# EAGLE design pulse-generator (EAGLE 7.7.0)

## Sheet 1 of 2
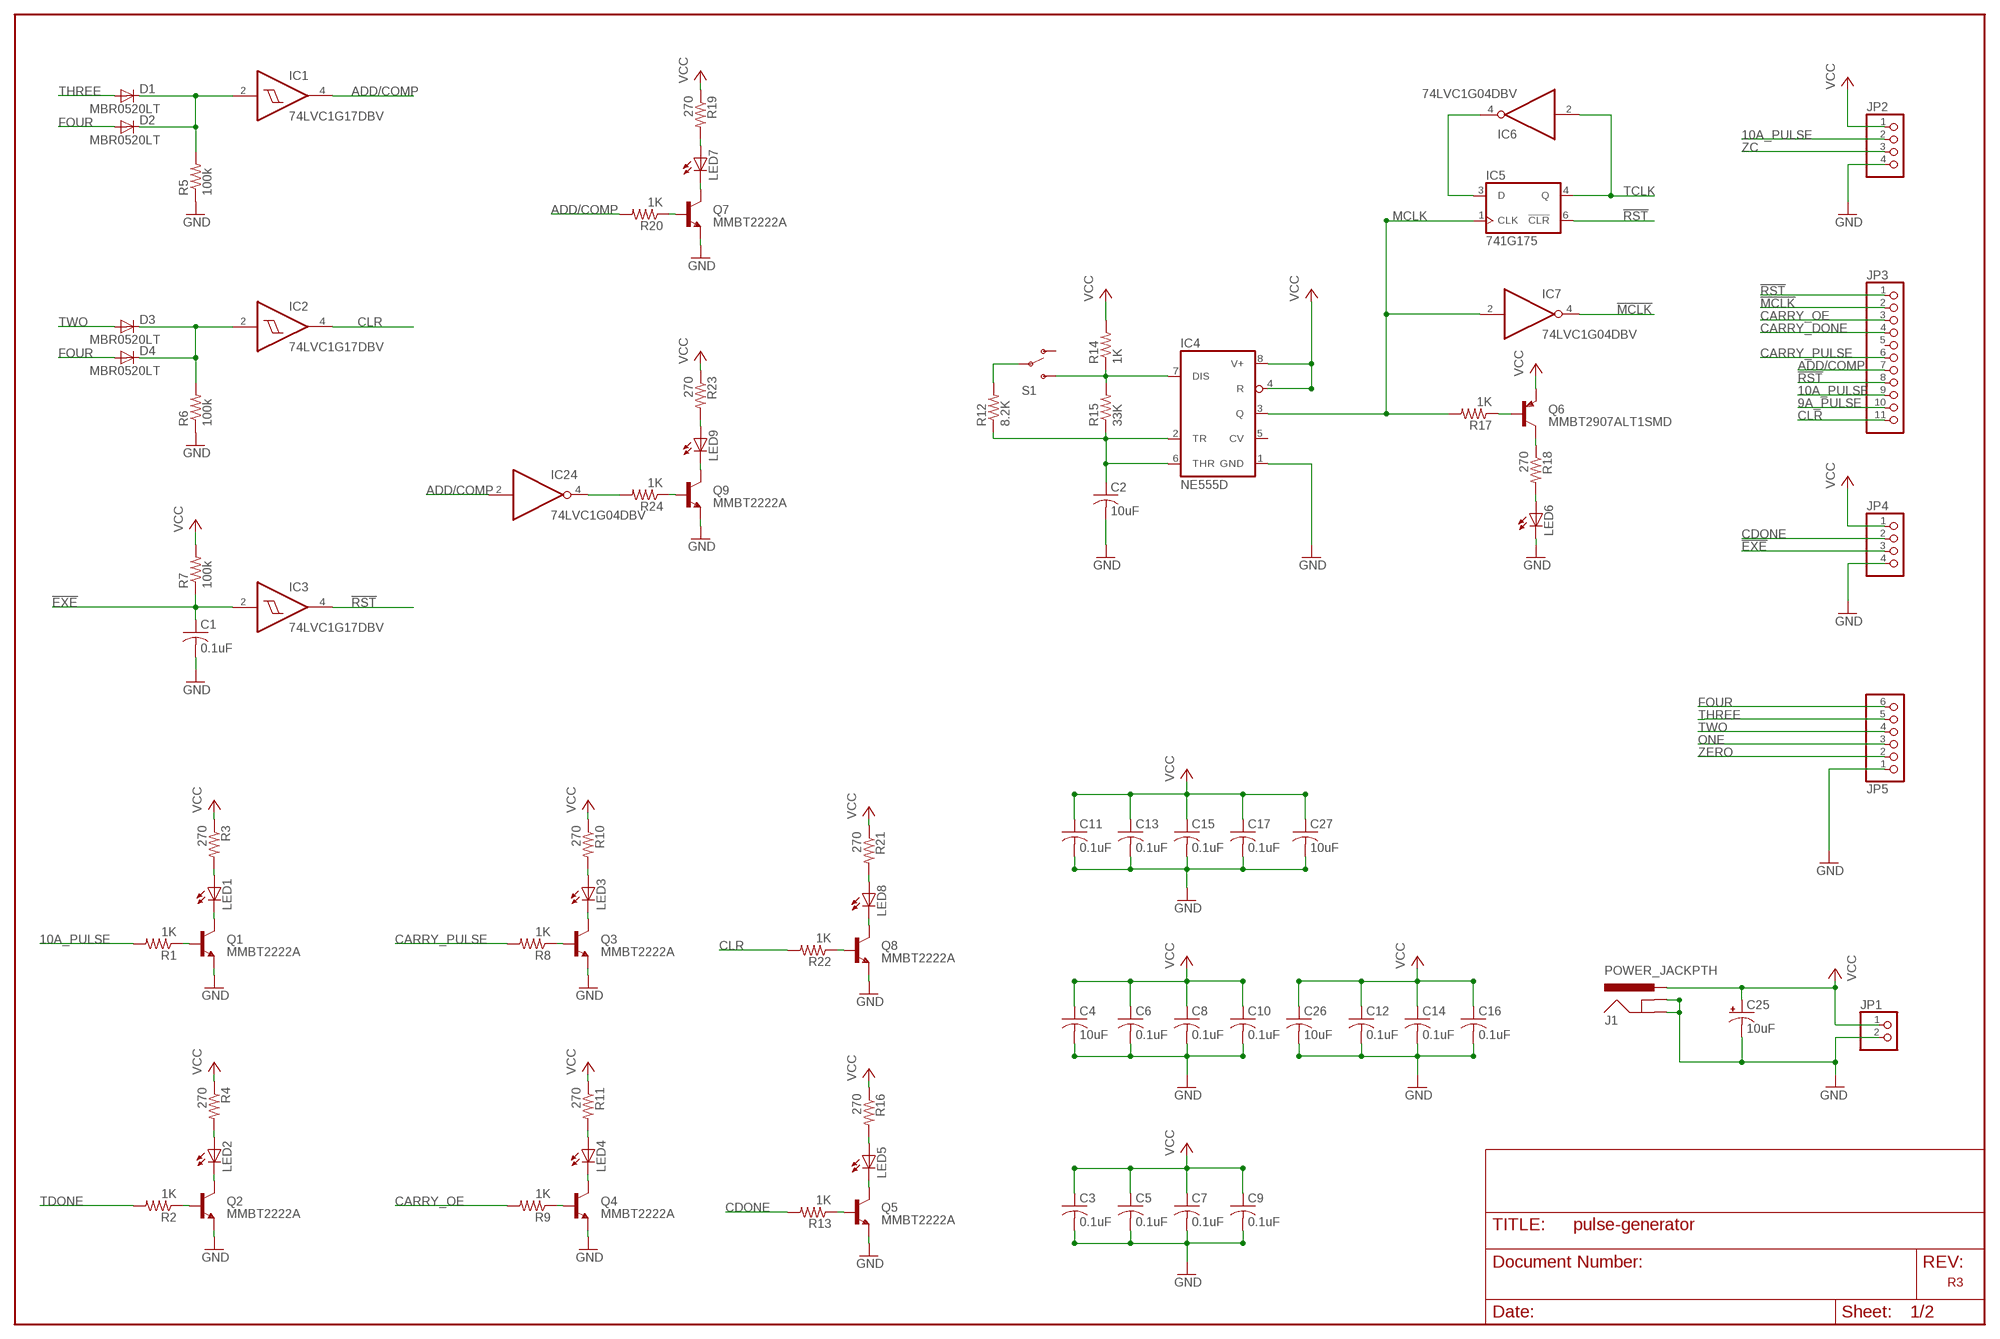
[diagram p0: schematic, sheet 1]

### Parts
C1  0.1uF  C-USC0805  [C0805]
C2  10uF  C-USC0805  [C0805]
C3  0.1uF  C-USC0603  [C0603]
C4  10uF  C-USC0805  [C0805]
C5  0.1uF  C-USC0603  [C0603]
C6  0.1uF  C-USC0603  [C0603]
C7  0.1uF  C-USC0805  [C0805]
C8  0.1uF  C-USC0603  [C0603]
C9  0.1uF  C-USC0603  [C0603]
C10  0.1uF  C-USC0603  [C0603]
C11  0.1uF  C-USC0603  [C0603]
C12  0.1uF  C-USC0603  [C0603]
C13  0.1uF  C-USC0603  [C0603]
C14  0.1uF  C-USC0603  [C0603]
C15  0.1uF  C-USC0603  [C0603]
C16  0.1uF  C-USC0603  [C0603]
C17  0.1uF  C-USC0603  [C0603]
C25  10uF  10UF-16V-10%(TANT)  [EIA3216]
C26  10uF  C-USC0805  [C0805]
C27  10uF  C-USC0805  [C0805]
D1  MBR0520LT  [SOD123]
D2  MBR0520LT  [SOD123]
D3  MBR0520LT  [SOD123]
D4  MBR0520LT  [SOD123]
IC1  74LVC1G17DBV  [SOT23-5]
IC2  74LVC1G17DBV  [SOT23-5]
IC3  74LVC1G17DBV  [SOT23-5]
IC4  NE555D  [SO08]
IC5  741G175  [DBV_R-PDSO-G6]
IC6  74LVC1G04DBV  [SOT23-5]
IC7  74LVC1G04DBV  [SOT23-5]
IC24  74LVC1G04DBV  [SOT23-5]
J1  POWER_JACKPTH  [POWER_JACK_PTH]
JP1  PINHD-1X2  [1X02]
JP2  PINHD-1X4  [1X04]
JP3  PINHD-1X11  [1X11]
JP4  PINHD-1X4  [1X04]
JP5  PINHD-1X6  [1X06]
LED1  LEDCHIP-LED0805  [CHIP-LED0805]
LED2  LEDCHIP-LED0805  [CHIP-LED0805]
LED3  LEDCHIP-LED0805  [CHIP-LED0805]
LED4  LEDCHIP-LED0805  [CHIP-LED0805]
LED5  LEDCHIP-LED0805  [CHIP-LED0805]
LED6  LEDCHIP-LED0805  [CHIP-LED0805]
LED7  LEDCHIP-LED0805  [CHIP-LED0805]
LED8  LEDCHIP-LED0805  [CHIP-LED0805]
LED9  LEDCHIP-LED0805  [CHIP-LED0805]
Q1  MMBT2222A  TRANSISTOR_NPNMMBT2222A  [SOT23-3]
Q2  MMBT2222A  TRANSISTOR_NPNMMBT2222A  [SOT23-3]
Q3  MMBT2222A  TRANSISTOR_NPNMMBT2222A  [SOT23-3]
Q4  MMBT2222A  TRANSISTOR_NPNMMBT2222A  [SOT23-3]
Q5  MMBT2222A  TRANSISTOR_NPNMMBT2222A  [SOT23-3]
Q6  MMBT2907ALT1SMD  [SOT23-BEC]
Q7  MMBT2222A  TRANSISTOR_NPNMMBT2222A  [SOT23-3]
Q8  MMBT2222A  TRANSISTOR_NPNMMBT2222A  [SOT23-3]
Q9  MMBT2222A  TRANSISTOR_NPNMMBT2222A  [SOT23-3]
R1  1K  R-US_R0805  [R0805]
R2  1K  R-US_R0805  [R0805]
R3  270  R-US_R0805  [R0805]
R4  270  R-US_R0805  [R0805]
R5  100k  R-US_R0805  [R0805]
R6  100k  R-US_R0805  [R0805]
R7  100k  R-US_R0805  [R0805]
R8  1K  R-US_R0805  [R0805]
R9  1K  R-US_R0805  [R0805]
R10  270  R-US_R0805  [R0805]
R11  270  R-US_R0805  [R0805]
R12  8.2K  R-US_R0805  [R0805]
R13  1K  R-US_R0805  [R0805]
R14  1K  R-US_R0805  [R0805]
R15  33K  R-US_R0805  [R0805]
R16  270  R-US_R0805  [R0805]
R17  1K  R-US_R0805  [R0805]
R18  270  R-US_R0805  [R0805]
R19  270  R-US_R0805  [R0805]
R20  1K  R-US_R0805  [R0805]
R21  270  R-US_R0805  [R0805]
R22  1K  R-US_R0805  [R0805]
R23  270  R-US_R0805  [R0805]
R24  1K  R-US_R0805  [R0805]
S1  SWITCH-SPDTPTH  [SWITCH-SPDT]

### Nets
9A_PULSE: JP3.10 ; also sheet 2
10A_PULSE: JP2.2 JP3.9 R1.2 ; also sheet 2
!EXE: C1.1 IC3.2(I) JP4.3 R7.1
!MCLK: IC7.4(O) JP3.2 ; also sheet 2
!RST: IC3.4(O) IC5.6(!CLR) JP3.1 JP3.8 ; also sheet 2
ADD/COMP: IC1.4(O) IC24.2(I) JP3.7 R20.2
CARRY_DONE: JP3.4 ; also sheet 2
CARRY_OE: JP3.3 R9.2 ; also sheet 2
CARRY_PULSE: JP3.6 R8.2 ; also sheet 2
CDONE: JP4.2 R13.2 ; also sheet 2
CLR: IC2.4(O) JP3.11 R22.2
FOUR: D2.A D4.A JP5.6
GND: C1.2 C2.2 C3.2 C4.2 C5.2 C6.2 C7.2 C8.2 C9.2 C10.2 C11.2 C12.2 C13.2 C14.2 C15.2 C16.2 C17.2 C25.C(-) C26.2 C27.2 IC4.1(GND) J1.GND J1.GNDBREAK JP1.2 JP2.4 JP4.4 JP5.1 LED6.C Q1.2(E) Q2.2(E) Q3.2(E) Q4.2(E) Q5.2(E) Q7.2(E) Q8.2(E) Q9.2(E) R5.1 R6.1 ; also sheet 2
MCLK: IC4.3(Q) IC5.1(CLK) IC7.2(I) R17.2
N$1: IC5.3(D) IC6.4(O)
N$2: C2.1 IC4.2(TR) IC4.6(THR) R12.1 R15.1
N$3: IC4.7(DIS) R14.1 R15.2 S1.3(S)
N$4: R12.2 S1.2(P)
N$5: Q6.B R17.1
N$6: Q6.C R18.1
N$7: LED6.A R18.2
N$10: LED3.C Q3.3(C)
N$12: LED7.C Q7.3(C)
N$13: LED1.C Q1.3(C)
N$14: Q7.1(B) R20.1
N$18: D1.C D2.C IC1.2(I) R5.2
N$19: D3.C D4.C IC2.2(I) R6.2
N$20: LED7.A R19.2
N$21: LED8.C Q8.3(C)
N$22: Q8.1(B) R22.1
N$24: Q3.1(B) R8.1
N$25: LED3.A R10.2
N$26: Q1.1(B) R1.1
N$27: LED8.A R21.2
N$28: LED1.A R3.2
N$29: LED9.C Q9.3(C)
N$30: Q9.1(B) R24.1
N$31: LED2.C Q2.3(C)
N$32: Q2.1(B) R2.1
N$33: LED2.A R4.2
N$34: LED4.C Q4.3(C)
N$35: Q4.1(B) R9.1
N$36: LED4.A R11.2
N$37: LED5.C Q5.3(C)
N$38: Q5.1(B) R13.1
N$39: LED5.A R16.2
N$40: LED9.A R23.2
N$41: IC24.4(O) R24.2
ONE: JP5.3
TCLK: IC5.4(Q) IC6.2(I) ; also sheet 2
TDONE: R2.2 ; also sheet 2
THREE: D1.A JP5.5
TWO: D3.A JP5.4
VCC: C3.1 C4.1 C5.1 C6.1 C7.1 C8.1 C9.1 C10.1 C11.1 C12.1 C13.1 C14.1 C15.1 C16.1 C17.1 C25.A(+) C26.1 C27.1 IC4.4(R) IC4.8(V+) J1.PWR JP1.1 JP2.1 JP4.1 Q6.E R3.1 R4.1 R7.2 R10.1 R11.1 R14.2 R16.1 R19.1 R21.1 R23.1 ; also sheet 2
ZC: JP2.3 ; also sheet 2
ZERO: JP5.2
Unconnected: IC4.5(CV) JP3.5 S1.1(O)

### Notes on the sheet
- R3

## Sheet 2 of 2
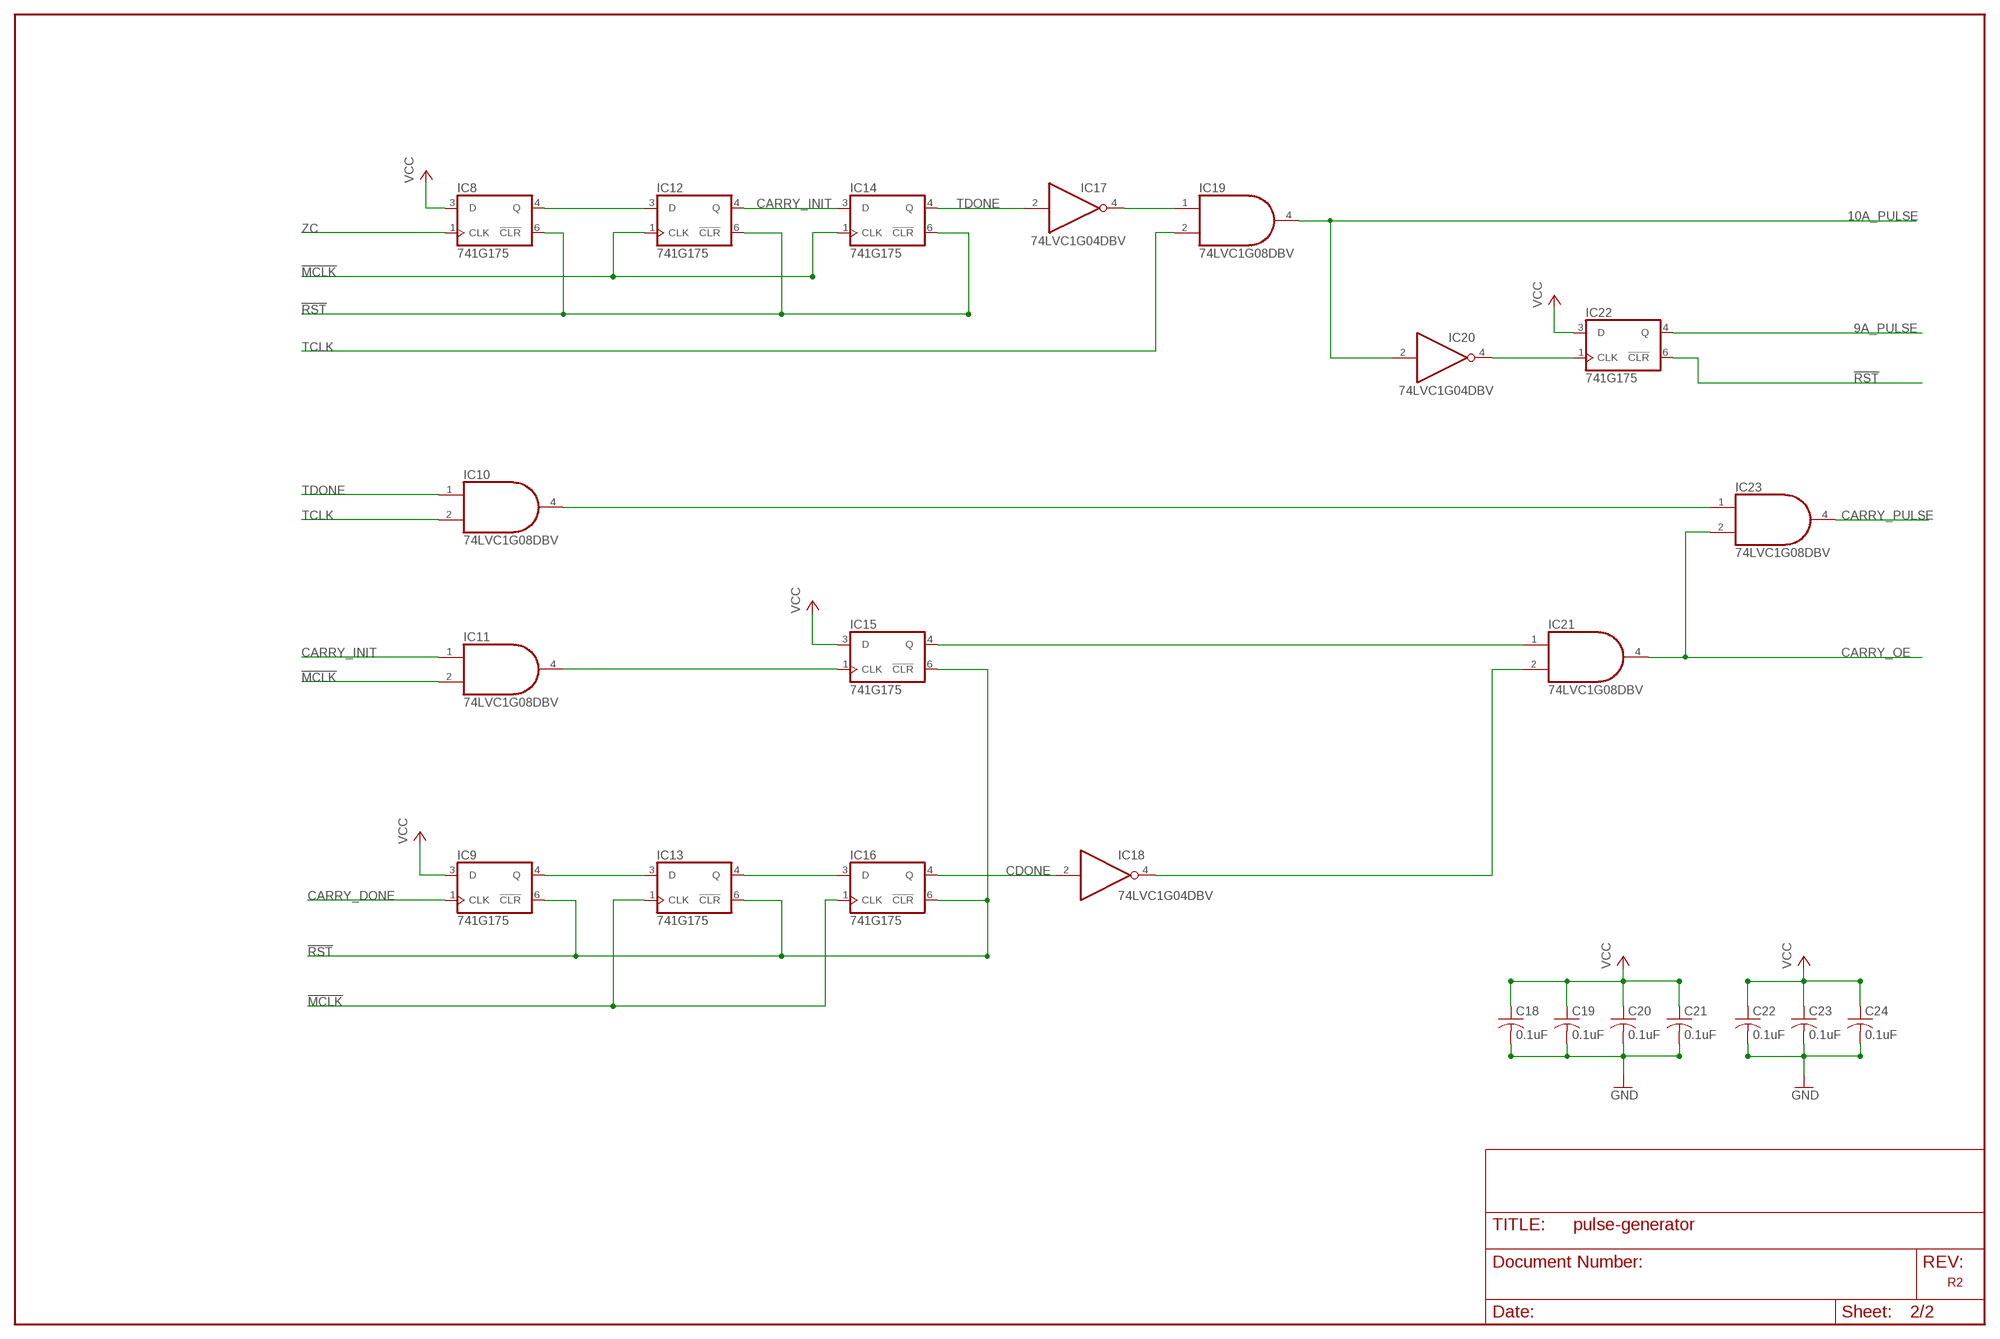
[diagram p1: schematic, sheet 2]

### Parts
C18  0.1uF  C-USC0603  [C0603]
C19  0.1uF  C-USC0603  [C0603]
C20  0.1uF  C-USC0603  [C0603]
C21  0.1uF  C-USC0603  [C0603]
C22  0.1uF  C-USC0603  [C0603]
C23  0.1uF  C-USC0603  [C0603]
C24  0.1uF  C-USC0603  [C0603]
IC8  741G175  [DBV_R-PDSO-G6]
IC9  741G175  [DBV_R-PDSO-G6]
IC10  74LVC1G08DBV  [SOT23-5]
IC11  74LVC1G08DBV  [SOT23-5]
IC12  741G175  [DBV_R-PDSO-G6]
IC13  741G175  [DBV_R-PDSO-G6]
IC14  741G175  [DBV_R-PDSO-G6]
IC15  741G175  [DBV_R-PDSO-G6]
IC16  741G175  [DBV_R-PDSO-G6]
IC17  74LVC1G04DBV  [SOT23-5]
IC18  74LVC1G04DBV  [SOT23-5]
IC19  74LVC1G08DBV  [SOT23-5]
IC20  74LVC1G04DBV  [SOT23-5]
IC21  74LVC1G08DBV  [SOT23-5]
IC22  741G175  [DBV_R-PDSO-G6]
IC23  74LVC1G08DBV  [SOT23-5]

### Nets
9A_PULSE: IC22.4(Q) ; also sheet 1
10A_PULSE: IC19.4(O) IC20.2(I) ; also sheet 1
!CDONE: IC18.4(O) IC21.2(I1)
!MCLK: IC11.2(I1) IC12.1(CLK) IC13.1(CLK) IC14.1(CLK) IC16.1(CLK) ; also sheet 1
!RST: IC8.6(!CLR) IC9.6(!CLR) IC12.6(!CLR) IC13.6(!CLR) IC14.6(!CLR) IC15.6(!CLR) IC16.6(!CLR) IC22.6(!CLR) ; also sheet 1
!TDONE: IC17.4(O) IC19.1(I0)
CARRY_DONE: IC9.1(CLK) ; also sheet 1
CARRY_INIT: IC11.1(I0) IC12.4(Q) IC14.3(D)
CARRY_OE: IC21.4(O) IC23.2(I1) ; also sheet 1
CARRY_PULSE: IC23.4(O) ; also sheet 1
CDONE: IC16.4(Q) IC18.2(I) ; also sheet 1
GND: C18.2 C19.2 C20.2 C21.2 C22.2 C23.2 C24.2 ; also sheet 1
N$8: IC8.4(Q) IC12.3(D)
N$9: IC10.4(O) IC23.1(I0)
N$11: IC9.4(Q) IC13.3(D)
N$15: IC15.4(Q) IC21.1(I0)
N$16: IC11.4(O) IC15.1(CLK)
N$17: IC13.4(Q) IC16.3(D)
N$23: IC20.4(O) IC22.1(CLK)
TCLK: IC10.2(I1) IC19.2(I1) ; also sheet 1
TDONE: IC10.1(I0) IC14.4(Q) IC17.2(I) ; also sheet 1
VCC: C18.1 C19.1 C20.1 C21.1 C22.1 C23.1 C24.1 IC8.3(D) IC9.3(D) IC15.3(D) IC22.3(D) ; also sheet 1
ZC: IC8.1(CLK) ; also sheet 1

### Notes on the sheet
- R2

## Power pins joined to a net without a drawn wire
GND: IC1.3(GND) IC2.3(GND) IC3.3(GND) IC5.2(GND) IC6.3(GND) IC7.3(GND) IC8.2(GND) IC9.2(GND) IC10.3(GND) IC11.3(GND) IC12.2(GND) IC13.2(GND) IC14.2(GND) IC15.2(GND) IC16.2(GND) IC17.3(GND) IC18.3(GND) IC19.3(GND) IC20.3(GND) IC21.3(GND) IC22.2(GND) IC23.3(GND) IC24.3(GND)
VCC: IC1.5(VCC) IC2.5(VCC) IC3.5(VCC) IC5.5(VCC) IC6.5(VCC) IC7.5(VCC) IC8.5(VCC) IC9.5(VCC) IC10.5(VCC) IC11.5(VCC) IC12.5(VCC) IC13.5(VCC) IC14.5(VCC) IC15.5(VCC) IC16.5(VCC) IC17.5(VCC) IC18.5(VCC) IC19.5(VCC) IC20.5(VCC) IC21.5(VCC) IC22.5(VCC) IC23.5(VCC) IC24.5(VCC)

## Library data of the parts
C1-C24 C26 C27 = resistor:C-US: CAPACITOR, American symbol
C25 = SparkFun-Capacitors:10UF-16V-10%(TANT): CAP-00811 1206/EIA-3216 Tantalum capacitor; PROD_ID: CAP-00811
D1-D4 = diode:MBR0520LT: SCHOTTKY BARRIER RECTIFIER Source: http://onsemi.com .. MBR0520LT1-D.pdf
IC1-IC3 = 74xx-little-us:74*1G17: Single Schmitt-Trigger Buffer
IC4 = adafruit:*555: TIMER Changed DIP package to have round (not oval) pin pads http://www.ladyada.net/library/pcb/eaglelibrary.html
IC5 IC8 IC9 IC12-IC16 IC22 = witch-e:74*1G175
IC6 IC7 IC17 IC18 IC20 IC24 = 74xx-little-us:74*1G04: INVERTER Gate
IC10 IC11 IC19 IC21 IC23 = 74xx-little-us:74*1G08: 2-input AND gate
J1 = SparkFun-Connectors:POWER_JACK: Power Jack This is the standard 5.5mm barrel jack for power. The PTH is the most common, proven, reliable, footprint. The Slot footprint only works if the mill layer is transmitted to the PCB fab house so be warned. Mating wall wart : TOL-00298 (and others); PROD_ID: PRT-00119
JP1 = custom-pinhead:PINHD-1X2: PIN HEADER
JP2 JP4 = custom-pinhead:PINHD-1X4: PIN HEADER
JP3 = custom-pinhead:PINHD-1X11: PIN HEADER
JP5 = custom-pinhead:PINHD-1X6: PIN HEADER
LED1-LED9 = led:LED: LED OSRAM: - CHIPLED LG R971, LG N971, LY N971, LG Q971, LY Q971, LO R971, LY R971 LH N974, LH R974 LS Q976, LO Q976, LY Q976 LO Q996 - Hyper CHIPLED LW Q18S LB Q993, LB Q99A, LB R99A - SideLED LS A670, LO A670, LY A670, LG A670, LP A670 LB A673, LV A673, LT A673, LW A673 LH A674 LY A675 LS A676, LA A676, LO A676, LY A676, LW A676 LS A679, LY A679, LG A679 - Hyper Micro SIDELED® LS Y876, LA Y876, LO Y876, LY Y876 LT Y87S - SmartLED LW L88C, LW L88S LB L89C, LB L89S, LG L890 LS L89K, LO L89K, LY L89K LS L896, LA L896, LO L896, LY L896 - TOPLED LS T670, LO T670, LY T670, LG T670, LP T670 LSG T670, LSP T670, LSY T670, LOP T670, LYG T670 LG T671, LOG T671, LSG T671 LB T673, LV T673, LT T673, LW T673 LH T674 LS T676, LA T676, LO T676, LY T676, LB T676, LH T676, LSB T676, LW T676 LB T67C, LV T67C, LT T67C, LS T67K, LO T67K, LY T67K, LW E67C LS E67B, LA E67B, LO E67B, LY E67B, LB E67C, LV E67C, LT E67C LW T67C LS T679, LY T679, LG T679 LS T770, LO T770, LY T770, LG T770, LP T770 LB T773, LV T773, LT T773, LW T773 LH T774 LS E675, LA E675, LY E675, LS T675 LS T776, LA T776, LO T776, LY T776, LB T776 LHGB T686 LT T68C, LB T68C - Hyper Mini TOPLED® LB M676 - Mini TOPLED Santana® LG M470 LS M47K, LO M47K, LY M47K Source: http://www.osram.convergy.de LUXEON: - LUMILED® LXK2-PW12-R00, LXK2-PW12-S00, LXK2-PW14-U00, LXK2-PW14-V00 LXK2-PM12-R00, LXK2-PM12-S00, LXK2-PM14-U00 LXK2-PE12-Q00, LXK2-PE12-R00, LXK2-PE12-S00, LXK2-PE14-T00, LXK2-PE14-U00 LXK2-PB12-K00, LXK2-PB12-L00, LXK2-PB12-M00, LXK2-PB14-N00, LXK2-PB14-P00, LXK2-PB14-Q00 LXK2-PR12-L00, LXK2-PR12-M00, LXK2-PR14-Q00, LXK2-PR14-R00 LXK2-PD12-Q00, LXK2-PD12-R00, LXK2-PD12-S00 LXK2-PH12-R00, LXK2-PH12-S00 LXK2-PL12-P00, LXK2-PL12-Q00, LXK2-PL12-R00 Source: www.luxeon.com KINGBRIGHT: KA-3528ASYC Source: www.kingbright.com
Q1-Q5 Q7-Q9 = SparkFun-DiscreteSemi:TRANSISTOR_NPN: Generic NPN BJT MMBT2222A - TRANS-08049 (SOT-23, 1A 40V) MPSA42 - TRANS-09116 (SOT-23, 500mA 300V) MMBT5088LT1G - TRANS-11160 (SOT-23, 50 mA 30V) BC547 - COM-08928 <http://www.sparkfun.com/products/8928> (TO-92 45V 100mA) (1.Collector 2.Base 3.Emitter) 2N3904 - COM-00521 <http://www.sparkfun.com/products/521> (TO-92 40V 200mA) (1.Emitter 2.Base 3.Collector) P2N2222A - COM-12852 <http://www.sparkfun.com/products/12852> (TO-92 40V 600mA) (1.Collector 2.Base 3.Emitter); PROD_ID: TRANS-08049
Q6 = transistor-pnp:MMBT2907*: PNP Transistror
R1-R24 = resistor:R-US_: RESISTOR, American symbol
S1 = SparkFun-Electromechanical:SWITCH-SPDT: SPDT Switch Simple slide switch, Spark Fun Electronics SKU : COM-00102 DPDT SMT slide switch, AYZ0202, SWCH-08179; PROD_ID: SWCH-08261

## Board
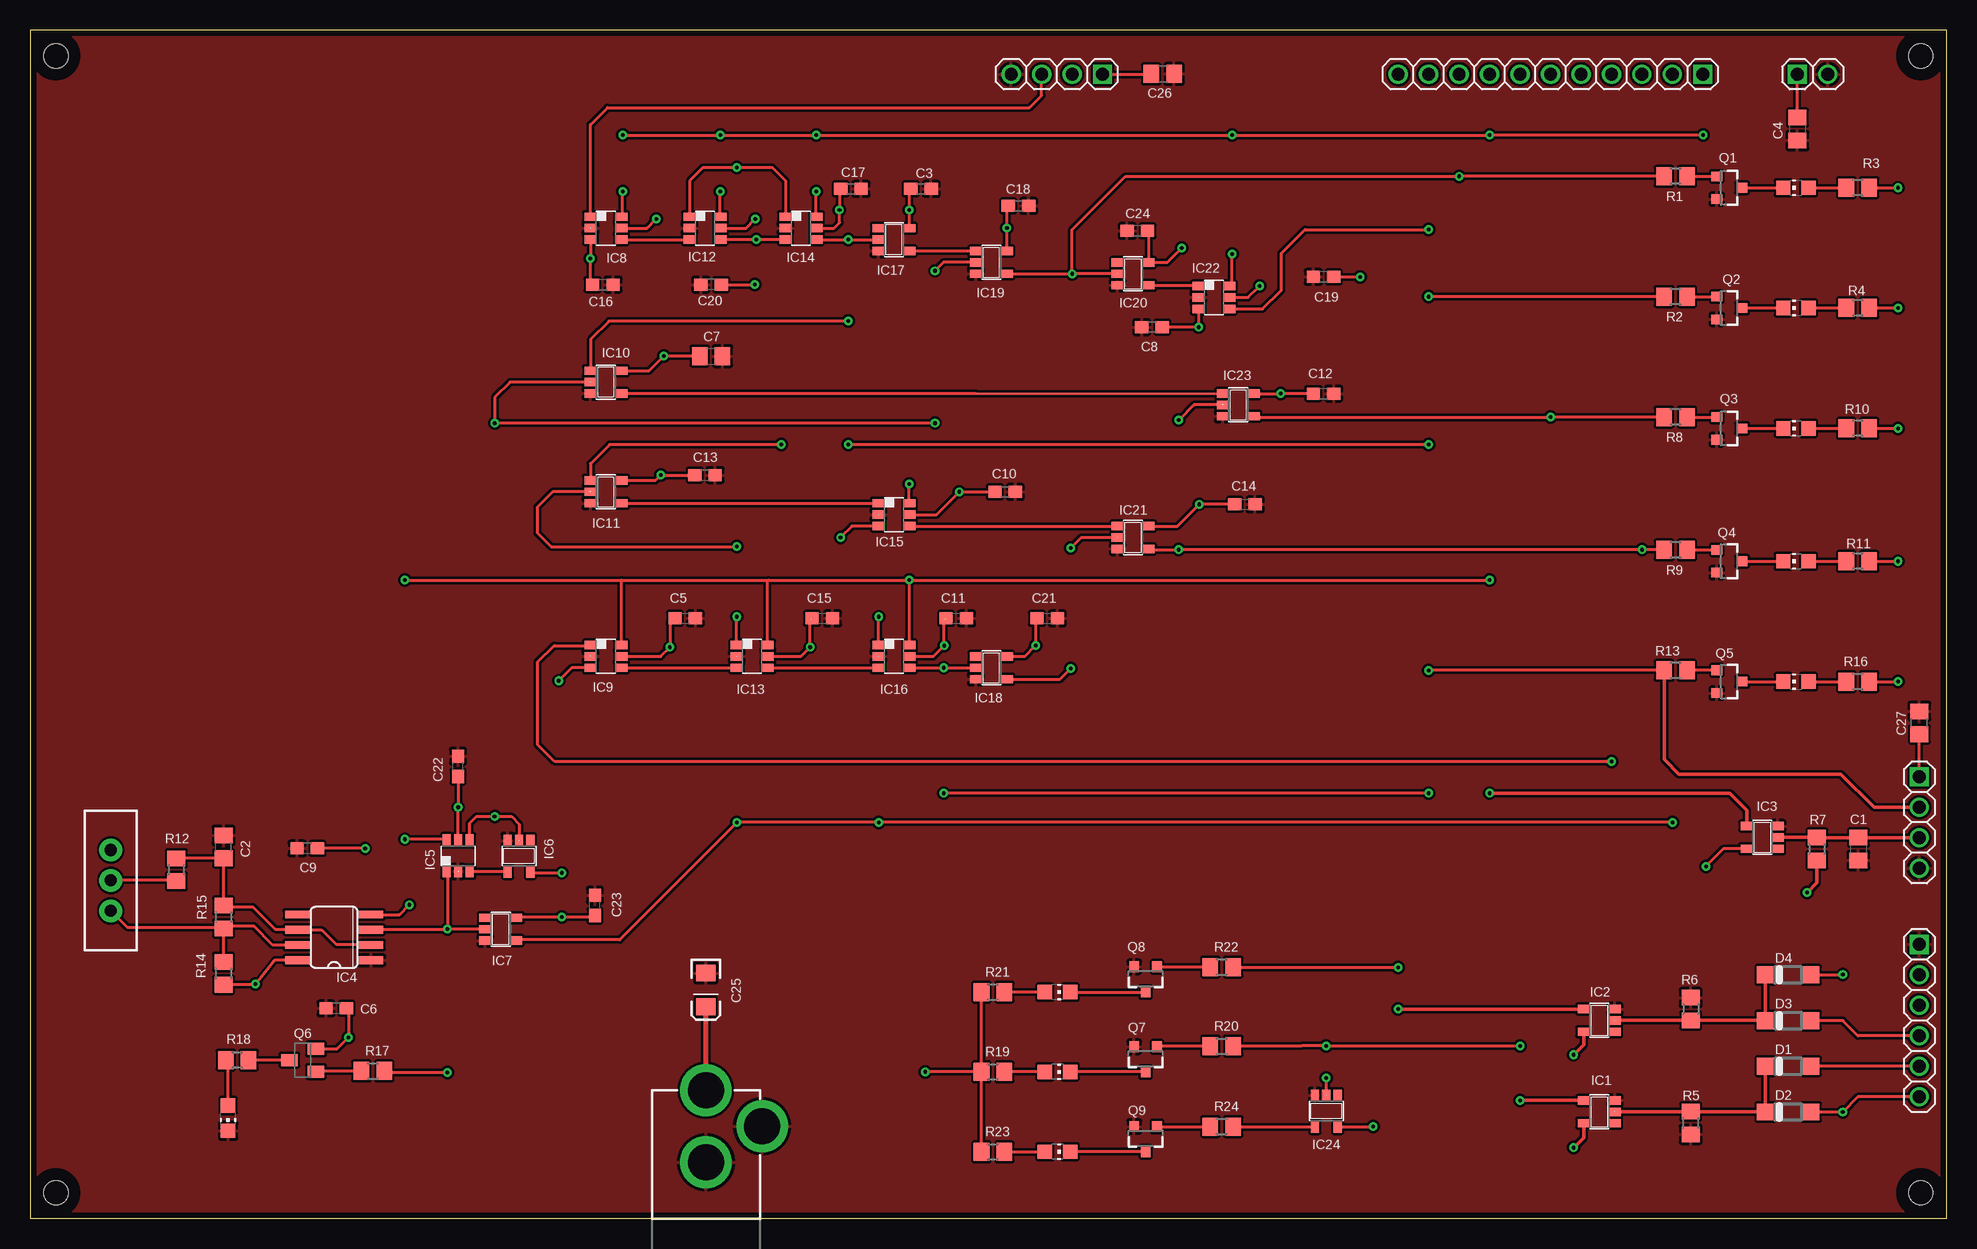
[diagram p2: board, top side]
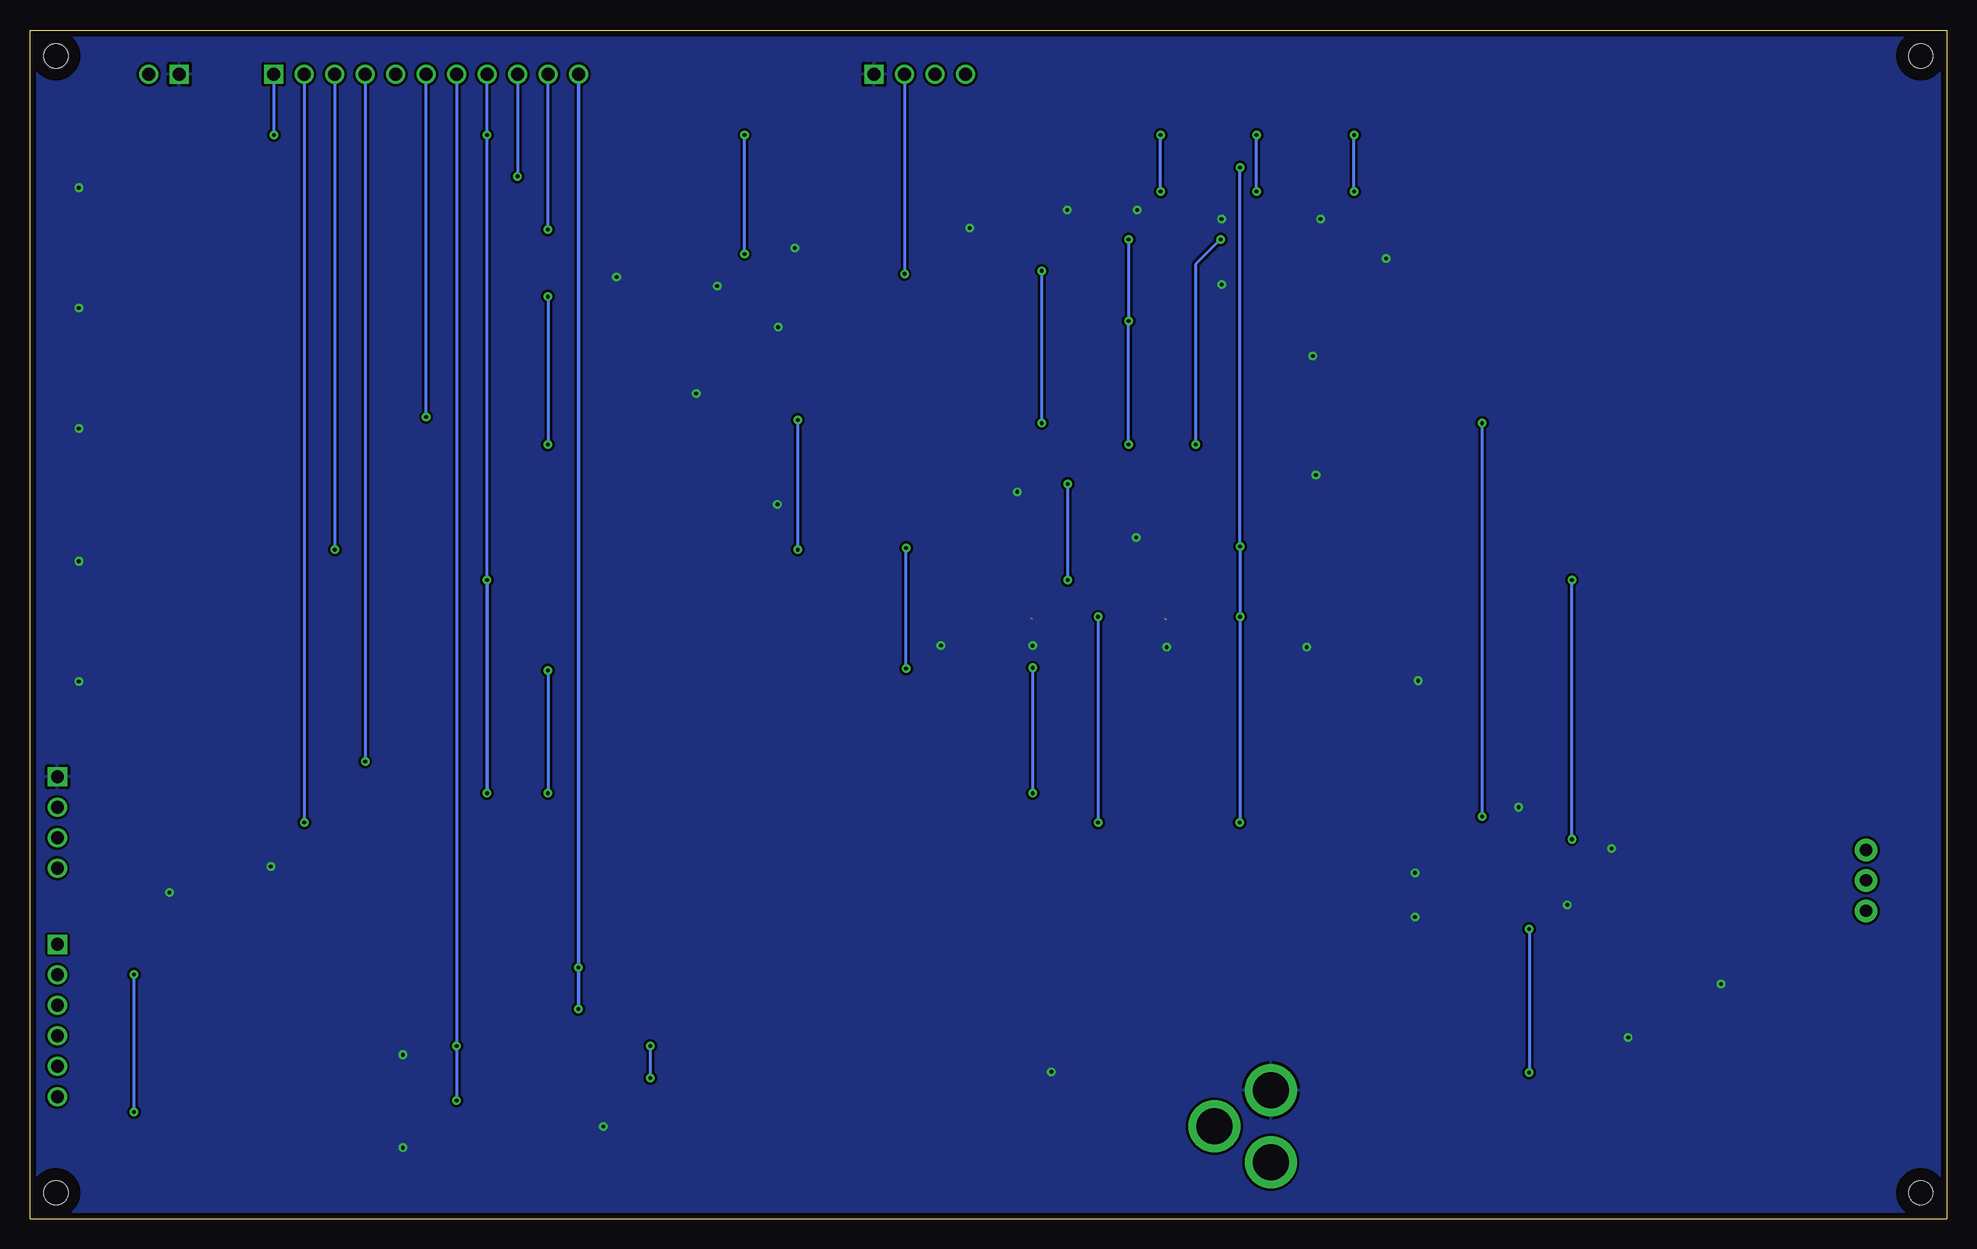
[diagram p3: board, bottom side, seen from below]

Size 159.77 x 99.06 mm. Coordinates in mm from the lower left corner, seen from the top.
Outline: 159.77,99.06 0,99.06 0,0 159.77,0 159.77,99.06
Copper layers (1*16): Top 0.035mm / dielectric 1.5mm / Bottom 0.035mm
Design rules "default *": minimum track width 8mil, minimum drill 12mil, track to track 8mil, track to pad 8mil, pad to pad 8mil, via to via 8mil, smd to smd 8mil, copper to edge 20mil, drill to drill 8mil, minimum pad ring 10mil, minimum via ring 8mil, stop-mask expansion 4mil, vias tented up to drill 0mil, thermal gap 10mil
Holes 2.01 mm at 2.16,2.16 157.61,2.16 157.61,96.9 2.16,96.9
tRestrict: area 155.6,0.2 to 159.6,4.2; area 155.6,94.9 to 159.6,98.9; area 0.2,94.9 to 4.2,98.9; area 0.2,0.2 to 4.2,4.2
bRestrict: area 155.6,0.2 to 159.6,4.2; area 155.6,94.9 to 159.6,98.9; area 0.2,94.9 to 4.2,98.9; area 0.2,0.2 to 4.2,4.2

### Footprints (pad centres in the part's own frame; a part is rotated, then mirrored left to right if it is on the bottom)
C0805 = smd 1.3 x 1.5: 1 -0.95,0; 2 0.95,0
C0603 = smd 1.1 x 1: 1 -0.85,0; 2 0.85,0
EIA3216 = smd 1.4 x 1.6: A 1.4,0; C -1.4,0
SOD123 = smd 1.4 x 1.4: A 1.9,0; C -1.9,0
SOT23-5 = smd 0.69 x 0.99: 1 -0.95,-1.29; 2 0,-1.29; 3 0.95,-1.29; 4 0.95,1.3; 5 -0.95,1.3
SO08 = smd 0.66 x 2.032: 1 -1.905,-3.073; 2 -0.635,-3.073; 3 0.635,-3.073; 4 1.905,-3.073; 5 1.905,3.073; 6 0.635,3.073; 7 -0.635,3.073; 8 -1.905,3.073
DBV_R-PDSO-G6 = smd 0.69 x 0.99: 1 -0.95,-1.29; 2 0,-1.29; 3 0.95,-1.29; 4 0.95,1.3; 5 0,1.3; 6 -0.95,1.3
POWER_JACK_PTH = drill 2.997 pad 4.318: GND 0,7.7; GNDBREAK 4.7,10.7; PWR 0,13.7
1X02 = drill 1.067 square: 1 -1.27,0 | drill 1.067: 2 1.27,0
1X04 = drill 1.067 square: 1 -3.81,0 | drill 1.067: 2 -1.27,0; 3 1.27,0; 4 3.81,0
1X11 = drill 1.067 square: 1 -12.7,0 | drill 1.067: 2 -10.16,0; 3 -7.62,0; 4 -5.08,0; 5 -2.54,0; 6 0,0; 7 2.54,0; 8 5.08,0; 9 7.62,0; 10 10.16,0; 11 12.7,0
1X06 = drill 1.067 square: 1 -6.35,0 | drill 1.067: 2 -3.81,0; 3 -1.27,0; 4 1.27,0; 5 3.81,0; 6 6.35,0
CHIP-LED0805 = smd 1.2 x 1.2: A 0,-1.05; C 0,1.05
SOT23-3 = smd 0.8 x 0.9: 1 -0.95,-1; 2 0.95,-1; 3 0,1.1
SOT23-BEC = smd 1 x 1.4: B -0.95,-1.1; C 0,1.1; E 0.95,-1.1
R0805 = smd 1.3 x 1.5: 1 -0.95,0; 2 0.95,0
SWITCH-SPDT = drill 1.016 pad 1.88: 1 0,2.54; 2 0,0; 3 0,-2.54

### Placement (x,y rotation side)
C1  152.4,30.81 270 top
C2  16.13,30.99 90 top
C3  74.27,85.83 0 top
C4  147.32,90.81 270 top
C5  54.61,50.04 0 top
C6  25.53,17.53 180 top
C7  56.77,71.88 0 top
C8  93.52,74.3 180 top
C9  23.11,30.86 180 top
C10  81.28,60.58 0 top
C11  77.22,50.04 0 top
C12  107.82,68.76 0 top
C13  56.26,61.98 0 top
C14  101.27,59.54 0 top
C15  66.04,50.04 0 top
C16  47.75,77.85 0 top
C17  68.43,85.83 0 top
C18  82.4,84.4 0 top
C19  107.82,78.49 180 top
C20  56.77,77.85 180 top
C21  84.79,50.04 0 top
C22  35.69,37.69 90 top
C23  47.09,26.11 90 top
C24  92.3,82.32 180 top
C25  56.34,19.08 270 top
C26  94.41,95.4 0 top
C27  157.48,41.33 90 top
D1  146.56,12.7 0 top
D2  146.56,8.89 0 top
D3  146.56,16.51 0 top
D4  146.56,20.32 0 top
IC1  130.81,8.9 90 top
IC2  130.81,16.52 90 top
IC3  144.4,31.78 90 top
IC4  25.35,23.44 90 top
IC5  35.69,30.23 0 top
IC6  40.77,30.23 180 top
IC7  39.24,24.13 270 top
IC8  48.01,82.55 270 top
IC9  48.01,46.86 270 top
IC10  48.01,69.72 270 top
IC11  48.01,60.58 270 top
IC12  56.26,82.55 270 top
IC13  60.2,46.86 270 top
IC14  64.26,82.55 270 top
IC15  72.01,58.67 270 top
IC16  72.01,46.86 270 top
IC17  72.01,81.6 270 top
IC18  80.14,45.91 270 top
IC19  80.14,79.69 270 top
IC20  91.95,78.74 270 top
IC21  91.95,56.77 270 top
IC22  98.68,76.77 270 top
IC23  100.71,67.82 270 top
IC24  108.05,8.98 180 top
J1  56.34,-3 0 top
JP1  148.59,95.38 0 top
JP2  85.6,95.38 180 top
JP3  126.75,95.38 180 top
JP4  157.48,33.02 270 top
JP5  157.48,16.51 270 top
LED1  147.19,85.92 90 top
LED2  147.19,75.9 90 top
LED3  147.19,65.86 90 top
LED4  147.19,54.79 90 top
LED5  147.19,44.75 90 top
LED6  16.51,8.38 180 top
LED7  85.65,12.24 270 top
LED8  85.65,18.88 270 top
LED9  85.65,5.58 270 top
Q1  141.6,85.92 270 top
Q2  141.6,75.9 270 top
Q3  141.6,65.86 270 top
Q4  141.6,54.79 270 top
Q5  141.6,44.75 270 top
Q6  22.73,13.21 90 top
Q7  92.99,13.34 180 top
Q8  92.99,19.99 180 top
Q9  92.99,6.68 180 top
R1  137.16,86.87 180 top
R2  137.16,76.83 180 top
R3  152.35,85.92 180 top
R4  152.35,75.9 180 top
R5  138.43,7.98 90 top
R6  138.43,17.48 270 top
R7  148.95,30.81 270 top
R8  137.16,66.8 180 top
R9  137.16,55.73 180 top
R10  152.35,65.86 180 top
R11  152.35,54.79 180 top
R12  12.19,29.08 270 top
R13  137.16,45.69 180 top
R14  16.13,20.45 270 top
R15  16.13,25.15 270 top
R16  152.35,44.75 180 top
R17  28.57,12.32 0 top
R18  17.27,13.21 180 top
R19  80.26,12.24 0 top
R20  99.34,14.38 0 top
R21  80.26,18.88 0 top
R22  99.34,20.97 0 top
R23  80.26,5.58 0 top
R24  99.34,7.68 0 top
S1  6.73,28.19 0 top

### Tracks (layer width: path | path; a pad name or v marks a point on that pad's centre or on a via)
9A_PULSE  (via drill 0.3)
  Top 0.254: v116.59,82.42 106.27,82.42 104.29,80.44 104.29,77.37 102.75,75.82 IC22.4
  Bottom 0.254: v116.59,82.42 JP3.10
10A_PULSE  (via drill 0.3)
  Top 0.254: IC20.2 v86.87,78.74 | v86.87,78.74 86.87,82.42 91.31,86.87 v119.13,86.87 R1.2 | IC19.4 v86.87,78.74
  Bottom 0.254: JP3.9 v119.13,86.87 | JP2.2 v86.87,78.74
!CDONE  (via drill 0.3)
  Top 0.254: IC18.4 85.86,44.96 v86.74,45.85 | IC21.2 87.63,56.77 87.06,56.2 v86.74,55.88
  Bottom 0.254: v86.74,45.85 v86.74,55.88
!EXE
  Top 0.305: IC3.2 148.93,31.77 R7.1 C1.1 JP4.3
!MCLK  (via drill 0.3)
  Top 0.254: v136.91,33.02 v70.74,33.02 v58.93,33.02 49.15,23.24 40.6,23.24 IC7.4 | IC16.1 70.72,50.15 v70.74,50.16 | IC14.1 62.99,83.52 62.99,86.49 61.87,87.61 v58.91,87.61 56.11,87.61 54.99,86.49 54.99,83.52 IC12.1 | IC11.2 43.56,60.58 42.29,59.31 42.29,57.15 43.43,56.01 v58.91,56.01 | IC13.1 v58.91,50.16
  Bottom 0.254: JP3.2 v136.91,33.02 | 58.93,87.63 v58.91,87.61 v58.91,56.01 v58.91,50.16 58.91,50.04 58.91,33.04 v58.93,33.02 | v70.74,50.16 v70.74,33.02
!RST  (via drill 0.3)
  Top 0.254: 49.31,90.3 v49.4,90.3 v57.53,90.3 v65.53,90.3 v100.2,90.3 v121.67,90.3 v139.45,90.3 | IC22.6 100.2,77.94 v100.2,80.39 | IC9.6 49.31,53.21 | 61.59,53.21 v73.28,53.21 | v73.28,53.21 v121.67,53.21 | IC13.6 61.5,53.12 61.59,53.21 | IC16.6 73.31,53.18 v73.28,53.21 | IC12.6 arc-90 57.53,83.53 v57.53,85.6 | IC14.6 arc-90 65.53,83.53 v65.53,85.6 | IC8.6 arc90 49.4,83.6 v49.4,85.6 | v31.24,53.21 49.31,53.21 | 49.31,53.21 61.59,53.21 | IC5.6 34.64,31.62 v31.24,31.62 | IC15.6 arc-90 73.28,59.65 v73.28,61.21
  Top 0.305: v121.67,35.46 141.68,35.46 143.1,34.04 IC3.4
  Bottom 0.254: JP3.8 v121.67,90.3 v121.67,53.21 | v100.2,80.39 v100.2,90.3 | v57.53,85.6 v57.53,90.3 | v65.53,85.6 v65.53,90.3 | v49.4,85.6 v49.4,90.3 | JP3.1 v139.45,90.3 | v31.24,31.62 v31.24,53.21 | v73.28,61.21 v73.28,53.21
  Bottom 0.305: v121.67,53.21 v121.67,35.46
!TDONE
  Top 0.254: IC17.4 IC19.1
ADD/COMP  (via drill 0.3)
  Top 0.254: R20.2 100.31,14.4 106.02,14.4 v108.05,14.4 v124.21,14.4 | IC24.2 v108.05,11.73
  Top 0.305: v124.21,9.85 IC1.4
  Bottom 0.254: JP3.7 v124.21,14.4 v124.21,9.85 | v108.05,11.73 v108.05,14.4
CARRY_DONE  (via drill 0.3)
  Top 0.254: IC9.1 46.66,47.75 43.69,47.75 42.29,46.35 42.29,39.55 43.74,38.1 v131.83,38.1
  Bottom 0.254: JP3.4 v131.83,38.1
CARRY_INIT  (via drill 0.3)
  Top 0.254: 46.74,61.55 IC11.1 46.71,62.92 48.31,64.52 v62.61,64.52 | IC12.4 57.58,81.58 57.6,81.61 v60.53,81.61 v60.54,81.6 IC14.3
  Bottom 0.254: v60.53,81.61 62.61,79.53 v62.61,64.52
CARRY_OE  (via drill 0.3)
  Top 0.254: IC21.4 93.31,55.75 v95.76,55.75 v134.37,55.75 134.39,55.73 R9.2 | IC23.2 97.03,67.82 v95.76,66.55
  Bottom 0.254: JP3.3 v134.37,55.75 | v95.76,55.75 v95.76,66.55
CARRY_PULSE  (via drill 0.3)
  Top 0.254: IC23.4 102.08,66.8 v126.75,66.8 R8.2
  Bottom 0.254: v126.75,66.8 JP3.6
CDONE  (via drill 0.3)
  Top 0.254: IC16.4 v76.17,45.91 IC18.2 | R13.2 v116.59,45.7 | v116.59,35.46 v76.17,35.46
  Top 0.305: R13.2 136.21,38.29 137.44,37.06 150.95,37.06 153.72,34.29 JP4.2
  Bottom 0.254: v116.59,45.7 v116.59,35.46 | v76.17,35.46 v76.17,45.91
CLR  (via drill 0.3)
  Top 0.254: R22.2 100.32,20.94 v114.05,20.94
  Top 0.305: v114.05,17.47 IC2.4
  Bottom 0.305: JP3.11 v114.05,20.94 v114.05,17.47
FOUR  (via drill 0.3)
  Top 0.254: D4.A 148.48,20.34 v151.1,20.34 | D2.A v151.1,8.89 152.38,10.16 JP5.6
  Bottom 0.254: v151.1,20.34 v151.1,8.89
GND
  pour Top: 0,0 159.77,0 159.77,99.06 0,99.06
MCLK  (via drill 0.3)
  Top 0.254: IC4.3 28.47,24.13 v34.8,24.13 | IC5.1 arc-90 34.8,28.88 v34.8,24.13 | IC7.2 v34.8,24.13 | R17.2 29.55,12.19 v34.8,12.19
  Bottom 0.254: v34.8,24.13 v34.8,12.19
N$1
  Top 0.254: IC5.3 39.81,28.94 IC6.4
N$2
  Top 0.254: IC4.2 28.37,22.86 25.53,22.86 24.31,24.08 IC4.6 22.23,24.13 20.45,24.13 18.58,26 16.13,26 R15.1 C2.1 R12.1
N$3
  Top 0.254: IC4.7 20.24,22.81 18.67,24.38 16.22,24.38 R15.2 | R14.1 R15.2 | S1.3 8.09,24.3 16.13,24.3 R15.2
N$4
  Top 0.254: R12.2 12.15,28.19 S1.2
N$5
  Top 0.254: Q6.B 23.89,12.32 R17.1
N$6
  Top 0.254: Q6.C R18.1
N$7
  Top 0.254: LED6.A 16.51,13.12 R18.2
N$8
  Top 0.254: IC8.4 IC12.3
N$9
  Top 0.254: IC10.4 78.84,68.77 IC23.1
N$10
  Top 0.254: Q3.3 LED3.C
N$11
  Top 0.254: IC9.4 IC13.3
N$12
  Top 0.254: Q7.3 86.76,12.23 LED7.C
N$13
  Top 0.254: Q1.3 LED1.C
N$14
  Top 0.254: R20.1 93.98,14.38 Q7.1
N$15
  Top 0.254: IC15.4 IC21.1
N$16
  Top 0.254: IC11.4 IC15.1
N$17
  Top 0.254: IC13.4 IC16.3
N$18
  Top 0.305: D1.C D2.C 144.65,8.9 138.45,8.9 R5.2 132.12,8.93 IC1.2
N$19
  Top 0.305: D4.C D3.C 144.65,16.52 R6.2 IC2.2
N$20
  Top 0.254: LED7.A R19.2
N$21
  Top 0.254: LED8.C Q8.3
N$22
  Top 0.254: R22.1 93.95,20.97 Q8.1
N$23
  Top 0.254: IC20.4 97.32,77.79 IC22.1
N$24
  Top 0.254: R8.1 Q3.1
N$25
  Top 0.254: LED3.A R10.2
N$26
  Top 0.254: Q1.1 R1.1
N$27
  Top 0.254: LED8.A R21.2
N$28
  Top 0.254: LED1.A R3.2
N$29
  Top 0.254: Q9.3 LED9.C
N$30
  Top 0.254: Q9.1 R24.1
N$31
  Top 0.254: Q2.3 LED2.C
N$32
  Top 0.254: R2.1 140.6,76.83 Q2.1
N$33
  Top 0.254: LED2.A R4.2
N$34
  Top 0.254: Q4.3 LED4.C
N$35
  Top 0.254: R9.1 140.6,55.73 Q4.1
N$36
  Top 0.254: LED4.A R11.2
N$37
  Top 0.254: Q5.3 LED5.C
N$38
  Top 0.254: Q5.1 138.12,45.7 R13.1
N$39
  Top 0.254: LED5.A R16.2
N$40
  Top 0.254: R23.2 LED9.A
N$41
  Top 0.254: R24.2 IC24.4
TCLK  (via drill 0.3)
  Top 0.254: IC5.4 36.64,32.95 37.21,33.53 v38.73,33.53 40.13,33.53 40.77,32.89 IC6.2 | IC19.2 76.14,79.69 v75.44,78.99 | v75.44,66.29 v38.73,66.29 38.73,68.45 40.01,69.72 IC10.2
  Bottom 0.254: v38.73,66.29 v38.73,33.53 | v75.44,78.99 v75.44,66.29
TDONE  (via drill 0.3)
  Top 0.254: IC14.4 v68.2,81.6 IC17.2 | v68.2,74.8 48.26,74.8 46.74,73.28 46.74,70.69 IC10.1 | R2.2 v116.59,76.83 | v116.59,64.52 v68.2,64.52
  Bottom 0.254: v68.2,64.52 v68.2,74.8 v68.2,81.6 | v116.59,76.83 v116.59,64.52
THREE
  Top 0.254: JP5.5 D1.A
TWO
  Top 0.254: JP5.4 152.38,15.24 151.1,16.51 D3.A
VCC  (via drill 0.3)  (2 unrouted)
  Top 0.254: IC4.4 30.81,25.35 v31.62,26.16 | IC4.8 20.4,21.54 v18.8,19.56 16.17,19.56 R14.2 | IC5.5 v35.69,34.29 C22.1 | IC6.5 arc90 41.81,28.83 v44.32,28.83 | IC7.5 40.61,25.15 v44.32,25.15 47.09,25.15 C23.1 | Q6.E 25.59,14.16 v26.54,15.11 26.54,17.46 C6.1 | C4.1 JP1.1 | IC15.3 68.52,57.72 v67.56,56.77 | IC18.5 82.93,46.86 v83.83,47.78 83.83,49.78 C21.1 | IC16.5 75.31,46.86 v76.2,47.75 76.2,49.97 | IC13.5 64.26,46.86 v65.02,47.62 65.02,49.97 | IC9.5 52.58,46.86 v53.34,47.62 53.34,49.72 C5.1 | IC9.3 45.15,45.91 v44.07,44.83 44.13,44.77 | IC10.5 51.62,70.67 v52.83,71.88 C7.1 | IC8.5 51.44,82.55 v52.2,83.31 | IC12.5 59.69,82.55 v60.45,83.31 60.52,83.38 | IC22.5 101.54,76.77 v102.49,77.72 | v27.94,30.86 C9.1 | IC3.5 141.16,30.82 v139.7,29.36 | C16.1 46.72,77.94 46.71,77.94 v46.71,80.01 IC8.3 | IC11.5 52.13,61.53 v52.58,61.98 C13.1 | v96.01,80.9 94.8,79.69 IC20.5 93.25,82.23 arc90 C24.1 | IC22.3 97.41,75.82 v97.41,74.3 C8.1 | C19.1 v110.87,78.49 | IC23.5 102.02,68.76 v104.24,68.76 C12.1 | R3.1 v155.7,85.92 | R4.1 v155.7,75.89 | R11.1 v155.7,54.79 | R10.1 v155.7,65.86 | R16.1 v155.7,44.76 | IC17.5 v73.3,84.07 73.3,85.81 C3.1 | IC19.5 v81.43,82.55 81.43,84.39 C18.1 | IC15.5 75.56,58.67 v77.47,60.58 C10.1 | IC21.5 95.64,57.72 v97.46,59.54 C14.1 | C20.1 v60.43,77.85 | IC14.5 67.03,82.55 67.49,83.01 v67.49,84.06 v67.47,84.07 | v67.48,84.08 v67.47,84.07 | C17.1 67.47,85.72 v67.47,84.07 | JP2.1 93.46,95.38 C26.1 | JP4.1 C27.1 | R23.1 R19.1 | R19.1 R21.1 | R19.1 v74.62,12.24 | IC24.5 v111.96,7.68 v111.96,7.67
  Top 0.305: IC2.5 129.51,14.5 v128.68,13.66 | IC1.5 129.51,6.75 v128.68,5.92 | R7.2 148.95,27.99 v148.13,27.18
  Top 0.406: J1.PWR C25.A
  pour Bottom: 0,0 159.77,0 159.77,99.06 0,99.06
ZC
  Top 0.254: IC8.1 46.72,91.17 48.13,92.58 83.31,92.58 84.33,93.6 JP2.3

### Text on the board
Document: 10A PULSE | Pulse Generator | Revision 3 | TDONE | CARRY PULSE | CARRY_OE | CDONE | CLR | SUB | MCLK | ADD